# EAGLE schematic SIM7000 Shield ES (EAGLE 9.4.0)
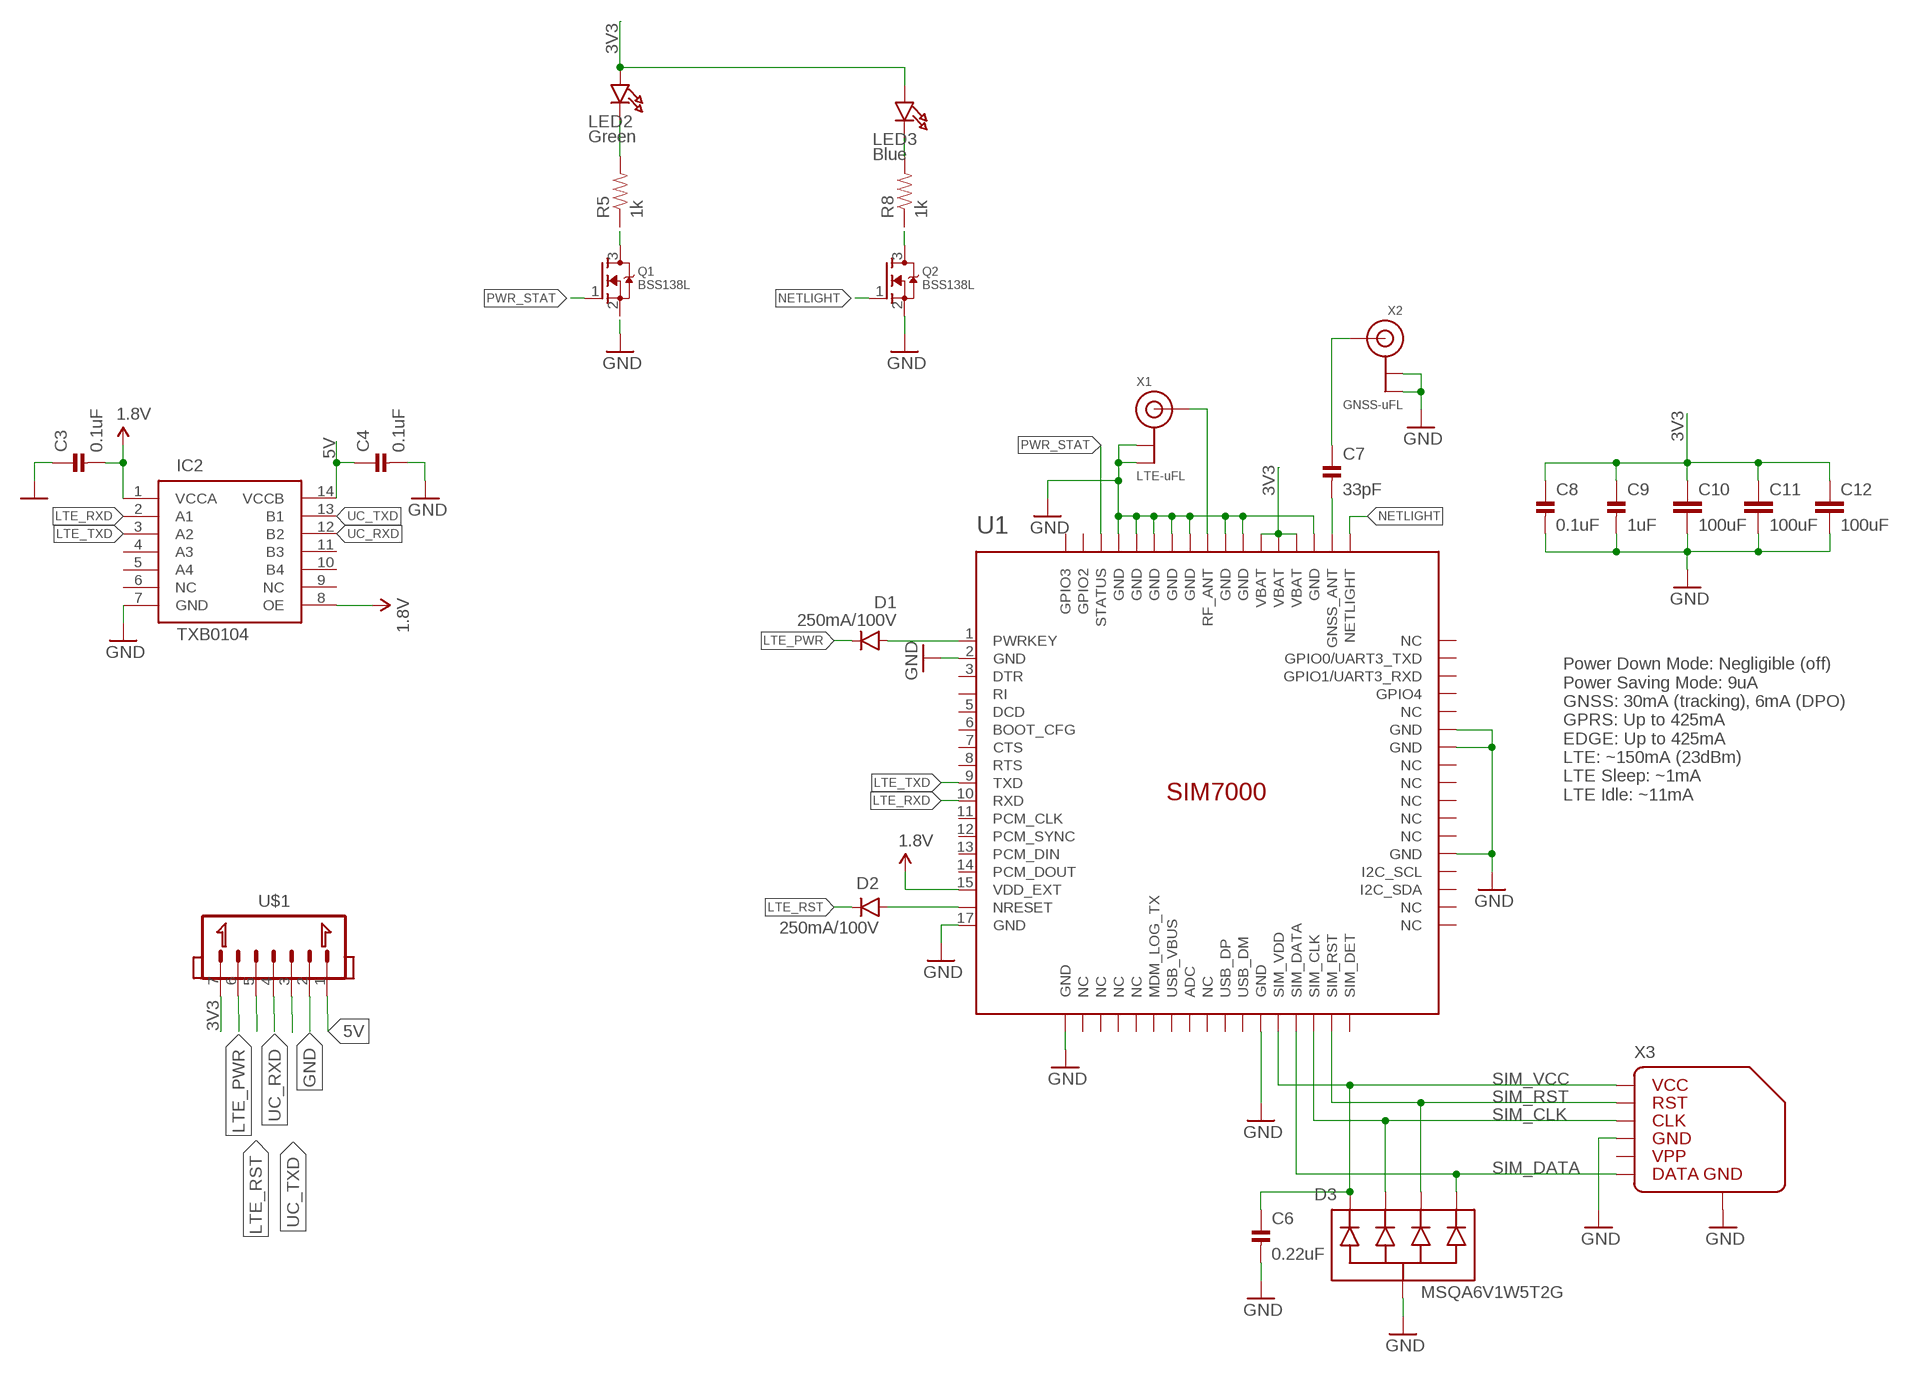
[diagram p0: schematic, sheet 1]

## Parts
C3  0.1uF  CAP_CERAMIC_0603  [CAP_0603]
C4  0.1uF  CAP_CERAMIC_0603  [CAP_0603]
C6  0.22uF  CAP_CERAMIC_0603  [CAP_0603]
C7  33pF  CAP_CERAMIC_0603  [CAP_0603]
C8  0.1uF  CAP_CERAMIC_0603  [CAP_0603]
C9  1uF  CAP_CERAMIC_0603  [CAP_0603]
C10  100uF  CAPMARKED-1210  [1210]
C11  100uF  CAPMARKED-1210  [1210]
C12  100uF  CAPMARKED-1210  [1210]
D1  250mA/100V  DIODESOD323  [SOD-323]
D2  250mA/100V  DIODESOD323  [SOD-323]
D3  MSQA6V1W5T2G  TVS-DIODE-ARRAY-4X  [SOT-353]
IC2  TXB0104  LEVEL_SHIFTER_TXB0104  [TSSOP-14]
LED2  Green  LED0603  [MICROBUILDER_CHIPLED_0603]
LED3  Blue  LED0603  [MICROBUILDER_CHIPLED_0603]
Q1  BSS138L  MOSFET-NGENERIC  [SOT23-3]
Q2  BSS138L  MOSFET-NGENERIC  [SOT23-3]
R5  1k  RESISTOR0603  [0603]
R8  1k  RESISTOR0603  [0603]
U1  SIM7000  [SIM7000]
U$1  JST_1.25_7P  [JST1.25_7P]
X1  LTE-uFL  ANTENNA_U.FL  [U.FL]
X2  GNSS-uFL  ANTENNA_U.FL  [U.FL]
X3  MICROSIM_SOCKET  [MICROSIM_SOCKET]

## Nets
1.8V: C3.2 IC2.1(VCCA) IC2.8(OE) U1.15(VDD_EXT)
3V3: C8.1 C9.1 C10.1 C11.1 C12.1 LED2.A LED3.A U1.55(VBAT) U1.56(VBAT) U1.57(VBAT) U$1.7
5V: C4.1 IC2.14(VCCB) U$1.1
GND: C3.1 C4.2 C6.2 C8.2 C9.2 C10.2 C11.2 C12.2 D3.2(COM) IC2.7(GND) Q1.2(S) Q2.2(S) U1.2(GND) U1.17(GND) U1.18(GND) U1.29(GND) U1.39(GND) U1.45(GND) U1.46(GND) U1.54(GND) U1.58(GND) U1.59(GND) U1.61(GND) U1.62(GND) U1.63(GND) U1.64(GND) U1.65(GND) U$1.2 X1.1(GND) X1.2(GND) X2.1(GND) X2.2(GND) X3.C5 X3.GND@1(GND) X3.GND@2(GND) X3.GND@3(GND) X3.GND@4(GND) X3.GND@5(GND) X3.GND@6(GND) X3.GND@7(GND) X3.GND@8(GND) X3.GND@9(GND) X3.GND@10(GND)
LTE_PWR: D1.C U$1.6
LTE_RST: D2.C U$1.5
LTE_RXD: IC2.2(A1) U1.10(RXD)
LTE_TXD: IC2.3(A2) U1.9(TXD)
N$1: C7.2 U1.53(GNSS_ANT)
N$2: D1.A U1.1(PWRKEY)
N$3: C7.1 X2.3(SIGNAL)
N$4: Q1.3(D) R5.1
N$5: LED2.C R5.2
N$9: LED3.C R8.2
N$10: Q2.3(D) R8.1
NETLIGHT: Q2.1(G) U1.52(NETLIGHT)
NRESET: D2.A U1.16(NRESET)
PWR_STAT: Q1.1(G) U1.66(STATUS)
RF_ANT: U1.60(RF_ANT) X1.3(SIGNAL)
SIM_CLK: D3.3 U1.32(SIM_CLK) X3.C3
SIM_DATA: D3.5 U1.31(SIM_DATA) X3.C7
SIM_RST: D3.4 U1.33(SIM_RST) X3.C2
SIM_VCC: C6.1 D3.1 U1.30(SIM_VDD) X3.C1
UC_RXD: IC2.12(B2) U$1.4
UC_TXD: IC2.13(B1) U$1.3
Unconnected: IC2.4(A3) IC2.5(A4) IC2.6(NC) IC2.9(NC) IC2.10(B4) IC2.11(B3) U1.3(DTR) U1.4(RI) U1.5(DCD) U1.6(BOOT_CFG) U1.7(CTS) U1.8(RTS) U1.11(PCM_CLK) U1.12(PCM_SYNC) U1.13(PCM_DIN) U1.14(PCM_DOUT) U1.19(NC) U1.20(NC) U1.21(NC) U1.22(NC) U1.23(MDM_LOG_TX) U1.24(USB_VBUS) U1.25(ADC) U1.26(NC) U1.27(USB_DP) U1.28(USB_DM) U1.34(SIM_DET) U1.35(NC) U1.36(NC) U1.37(I2C_SDA) U1.38(I2C_SCL) U1.40(NC) U1.41(NC) U1.42(NC) U1.43(NC) U1.44(NC) U1.47(NC) U1.48(GPIO4) U1.49(GPIO1/UART3_RXD) U1.50(GPIO0/UART3_TXD) U1.51(NC) U1.67(GPIO2) U1.68(GPIO3) X3.C6

## Notes on the sheet
- Power Down Mode: Negligible (off)
  Power Saving Mode: 9uA
  GNSS: 30mA (tracking), 6mA (DPO)
  GPRS: Up to 425mA
  EDGE: Up to 425mA
  LTE: ~150mA (23dBm)
  LTE Sleep: ~1mA
  LTE Idle: ~11mA

## Library data of the parts
C3 C4 C6-C9 = Scott-Electrical:CAP_CERAMIC
C10-C12 = TimWoo-Capacitors:CAP: Capacitor Standard 0603 ceramic capacitor, and 0.1" leaded capacitor.
D1 D2 = TimWoo-Diodes:DIODE: Diode These are standard reverse protection diodes and small signal diodes. SMA package can handle up to about 1A. SOD-323 can handle about 200mA. What the SOD-323 package when ordering, there are some mfgs out there that are 5-pin packages.; PROD_ID: DIO-09646
D3 = TimWoo-Diodes:TVS-DIODE-ARRAY-4X
IC2 = Scott-ICs:LEVEL_SHIFTER_TXB0104
LED2 LED3 = Scott-Electrical:LED: LED 0603 - 0603 Surface Mount Package 2mA: Green LED - Low Power (3.9mcd, 2ma, 1.7Vf) - Digikey: 475-2709-2-ND Orange LED - Low Power (9.8mcd, 2ma, 1.8Vf) - Digikey: 475-1194-2-ND Red LED - Low Power (5mcd, 2ma, 1.8Vf) - Digikey: 475-1195-2-ND Yellow LED - Low Power (7mcd, 2ma, 1.8Vf) - Digikey: 475-1196-2-ND 5mA: Blue LED - Low Power (17mcd, 5ma, 2.9Vf) - Digikey: LNJ937W8CRACT-ND 0805 - 0805 Surface Mount Package 2mA: Red LED (8.8mcd, 2mA, 1.8Vf, Clear) - Low Power [Digikey: 475-2510-1-ND] Green LED (5mcd, 2mA, 1.8Vf, Clear) - Low Power [Digikey: 475-2730-1-ND] Yellow LED (11.3mcd, 2mA, 1.8Vf, Clear) - Low Power [Digikey: 475-2555-1-ND] 20mA: Red LED (104mcd, 20mA, Diffused) - LS R976 [Digikey: 475-1278-6-ND] Red LED (12mcd, 20mA, 2.0Vf, Clear) - APT2012EC [Digikey: 754-1128-1-ND] Green LED (15mcd, 20mA, 2.2Vf, Clear) - APT2012GC [Digikey: 754-1131-1-ND] Orange LED (160mcd, 20mA, 2.1Vf, Clear) - APT2012SECK [Digikey: 754-1130-1-ND] 1206 - 1206 Surface Mount Package Green LED (26mcd, 20mA, Diffused) - LG N971 [Digikey: 475-1407-6-ND] Red LED (15mcd, 20mA, Diffused) - LH N974 [Digikey: 475-1416-6-ND] Cree - Cree High-Power Surface Mount LEDs XPEBWT-L1-0000-00D50 - White 111lm 350mA 2.9Vf 6200K 110° XTEAWT-00-0000-00000LEE3 - White 114lm 350mA 2.85Vf 5000K 115° Everlight - Everlight 45-21 Series Surface Mount LEDs 45-21/QK2C-B2832AC2CB2/2T - Warm White 2000mcd 20mA 3.25Vf 3050K 120° 45-21/LK2C-B38452C4CB2/2T - Nuetral White 2000mcd 20mA 3.25Vf 4150K 120° 45-21/LK2C-B50634C6CB2/2T - Cold White 2200mcd 20mA 3.25Vf 5650K 120° PLCC2 Reverse Mount LS T77K-J1L2-1-0-2-R18-Z - Red 11.25mcd 2mA 1.8Vf 630nm 120° LO T77K-L1M2-24-Z - Orange 19.6mcd 2mA 1.8Vf 606nm 120° LY T77K-K2M1-26-Z - Yellow 15.7mcd 2mA 1.8Vf 587nm 120°
Q1 Q2 = TimWoo-MOSFETs:MOSFET-N: N-Channel Mosfet DMG2302UK - 20V 2.8A SOT23 [Digikey: DMG2302UK-7DICT-ND] 2N7002E - 60V 260mA SOT23 [Digikey: 2N7002ET1GOSTR-ND] - REEL BSH103 - 30V 850mA SOT23 [Digikey: 568-5013-1-ND]
R5 R8 = Scott-Electrical:RESISTOR: Generic Resistor Package
U1 = TimWoo-RF:SIM7000
U$1 = Scott-Connectors:JST_1.25_7P
X1 X2 = TimWoo-Connectors:ANTENNA_U.FL: U.FL Antenna Connector
X3 = Scott-Connectors:MICROSIM_SOCKET: https://detail.tmall.com/item.htm?spm=a230r.1.14.13.35ab360dMATvut&id=525433574500&cm_id=140105335569ed55e27b&abbucket=1

## Net classes
0 default: width 0.305 mm
1 power: width 0.406 mm